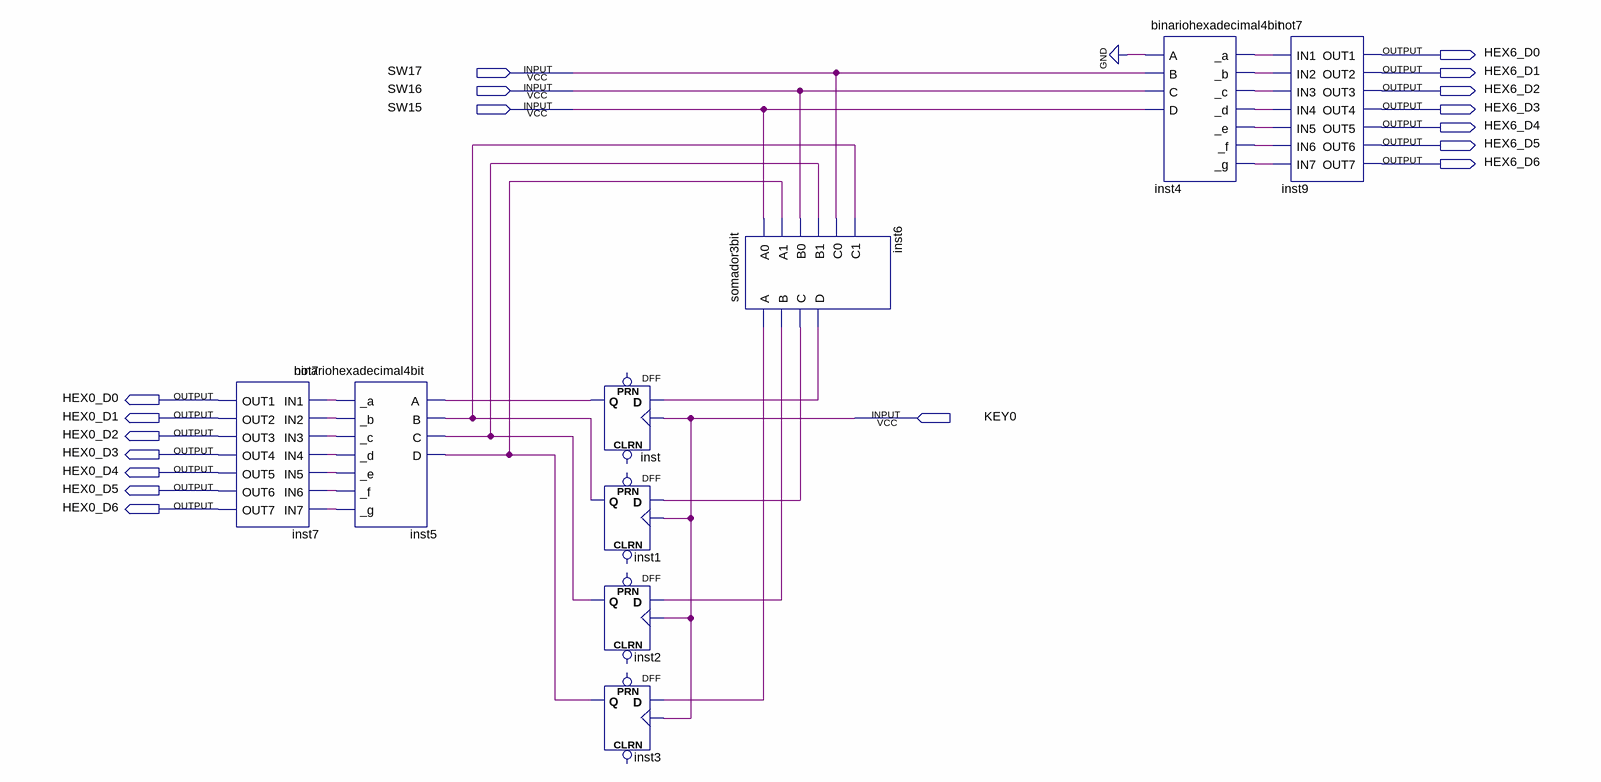
[diagram p0: schematic sheet]
// Quartus schematic main.bdf as structural Verilog: 9 symbols, 18 pins
module main (
  input  SW17,
  input  SW16,
  input  SW15,
  input  KEY0,
  output HEX6_D0,
  output HEX6_D1,
  output HEX6_D2,
  output HEX6_D3,
  output HEX6_D4,
  output HEX6_D5,
  output HEX6_D6,
  output HEX0_D0,
  output HEX0_D1,
  output HEX0_D2,
  output HEX0_D3,
  output HEX0_D4,
  output HEX0_D5,
  output HEX0_D6
);

  wire inst1_q, inst2_q, inst3_q, inst4__a, inst4__b, inst4__c, inst4__d, inst4__e, inst4__f, inst4__g,
       inst5__a, inst5__b, inst5__c, inst5__d, inst5__e, inst5__f, inst5__g, inst6_a, inst6_b, inst6_c,
       inst6_d, inst_q;

  not7 inst7 (
    .IN1(inst5__a), .IN2(inst5__b), .IN3(inst5__c), .IN4(inst5__d), .IN5(inst5__e), .IN6(inst5__f),
    .IN7(inst5__g), .OUT1(HEX0_D0), .OUT2(HEX0_D1), .OUT3(HEX0_D2), .OUT4(HEX0_D3), .OUT5(HEX0_D4),
    .OUT6(HEX0_D5), .OUT7(HEX0_D6));
  binariohexadecimal4bit inst5 (
    .A(inst_q), .B(inst1_q), .C(inst2_q), .D(inst3_q), ._a(inst5__a), ._b(inst5__b), ._c(inst5__c),
    ._d(inst5__d), ._e(inst5__e), ._f(inst5__f), ._g(inst5__g));
  DFF inst (.CLK(KEY0), .D(inst6_d), .Q(inst_q));  // open: CLRN, PRN
  DFF inst1 (.CLK(KEY0), .D(inst6_c), .Q(inst1_q));  // open: CLRN, PRN
  DFF inst2 (.CLK(KEY0), .D(inst6_b), .Q(inst2_q));  // open: CLRN, PRN
  DFF inst3 (.CLK(KEY0), .D(inst6_a), .Q(inst3_q));  // open: CLRN, PRN
  somador3bit inst6 (
    .A0(SW15), .A1(inst3_q), .B0(SW16), .B1(inst2_q), .C0(SW17), .C1(inst1_q), .A(inst6_a), .B(inst6_b),
    .C(inst6_c), .D(inst6_d));
  binariohexadecimal4bit inst4 (
    .A(1'b0), .B(SW17), .C(SW16), .D(SW15), ._a(inst4__a), ._b(inst4__b), ._c(inst4__c), ._d(inst4__d),
    ._e(inst4__e), ._f(inst4__f), ._g(inst4__g));
  not7 inst9 (
    .IN1(inst4__a), .IN2(inst4__b), .IN3(inst4__c), .IN4(inst4__d), .IN5(inst4__e), .IN6(inst4__f),
    .IN7(inst4__g), .OUT1(HEX6_D0), .OUT2(HEX6_D1), .OUT3(HEX6_D2), .OUT4(HEX6_D3), .OUT5(HEX6_D4),
    .OUT6(HEX6_D5), .OUT7(HEX6_D6));
endmodule
